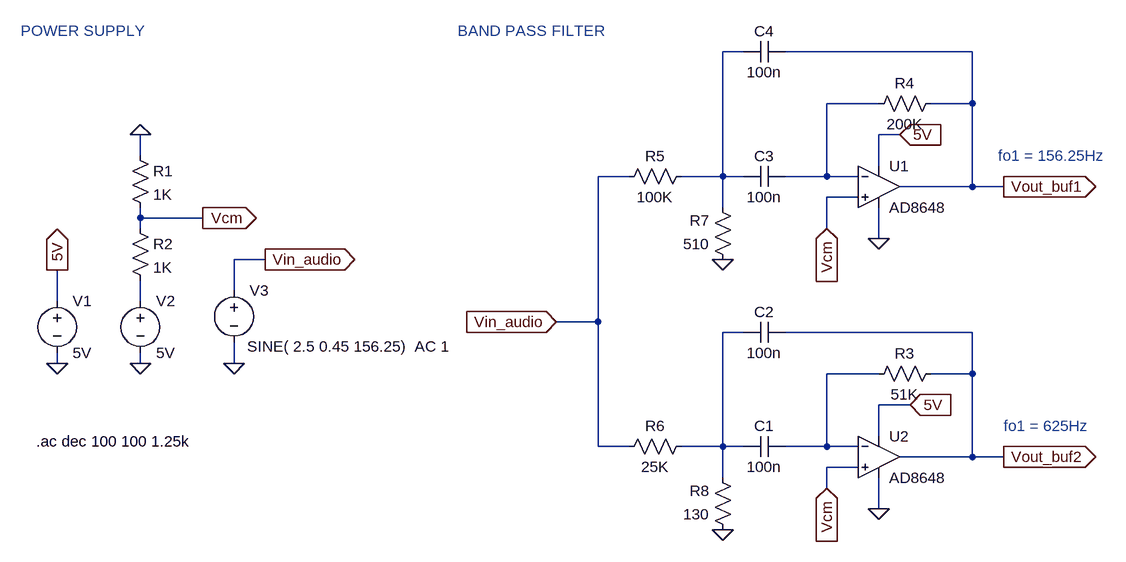
[diagram p0: schematic 04_Bandpass_Filter.asc.asc]
04_Bandpass_Filter.asc.asc, the LTspice schematic file:
Version 4.1
SHEET 1 1412 680
WIRE 656 -240 624 -240
WIRE 1008 -240 720 -240
WIRE 864 -160 784 -160
WIRE 1008 -160 1008 -240
WIRE 1008 -160 944 -160
WIRE 896 -112 864 -112
WIRE -272 -80 -272 -112
WIRE 864 -64 864 -112
WIRE 480 -48 432 -48
WIRE 624 -48 624 -240
WIRE 624 -48 560 -48
WIRE 656 -48 624 -48
WIRE 784 -48 784 -160
WIRE 784 -48 720 -48
WIRE 832 -48 784 -48
WIRE 1008 -32 1008 -160
WIRE 1008 -32 896 -32
WIRE 1056 -32 1008 -32
WIRE 832 -16 784 -16
WIRE 624 0 624 -48
WIRE -272 16 -272 0
WIRE -176 16 -272 16
WIRE -272 32 -272 16
WIRE 784 32 784 -16
WIRE 864 48 864 0
WIRE -80 80 -128 80
WIRE -128 128 -128 80
WIRE -400 144 -400 96
WIRE -272 144 -272 112
WIRE 432 176 432 -48
WIRE 432 176 368 176
WIRE 656 192 624 192
WIRE 1008 192 720 192
WIRE -400 240 -400 224
WIRE -272 240 -272 224
WIRE -128 240 -128 208
WIRE 864 256 784 256
WIRE 1008 256 1008 192
WIRE 1008 256 944 256
WIRE 912 304 864 304
WIRE 864 352 864 304
WIRE 432 368 432 176
WIRE 480 368 432 368
WIRE 624 368 624 192
WIRE 624 368 560 368
WIRE 656 368 624 368
WIRE 784 368 784 256
WIRE 784 368 720 368
WIRE 832 368 784 368
WIRE 1008 384 1008 256
WIRE 1008 384 896 384
WIRE 1056 384 1008 384
WIRE 832 400 784 400
WIRE 624 416 624 368
WIRE 784 432 784 400
WIRE 864 464 864 416
FLAG -400 240 0
FLAG -400 96 5V
IOPIN -400 96 Out
FLAG -272 240 0
FLAG -272 -112 0
FLAG -176 16 Vcm
IOPIN -176 16 Out
FLAG -128 240 0
FLAG -80 80 Vin_audio
IOPIN -80 80 Out
FLAG 864 48 0
FLAG 864 464 0
FLAG 784 32 Vcm
IOPIN 784 32 In
FLAG 784 432 Vcm
IOPIN 784 432 In
FLAG 896 -112 5V
IOPIN 896 -112 In
FLAG 912 304 5V
IOPIN 912 304 In
FLAG 624 80 0
FLAG 624 496 0
FLAG 368 176 Vin_audio
IOPIN 368 176 In
FLAG 1056 -32 Vout_buf1
IOPIN 1056 -32 Out
FLAG 1056 384 Vout_buf2
IOPIN 1056 384 Out
SYMBOL voltage -400 128 R0
WINDOW 123 0 0 Left 0
WINDOW 39 0 0 Left 0
SYMATTR InstName V1
SYMATTR Value 5V
SYMBOL voltage -272 128 R0
WINDOW 123 0 0 Left 0
WINDOW 39 0 0 Left 0
SYMATTR InstName V2
SYMATTR Value 5V
SYMBOL res -288 16 R0
SYMATTR InstName R2
SYMATTR Value 1K
SYMBOL res -288 -96 R0
SYMATTR InstName R1
SYMATTR Value 1K
SYMBOL voltage -128 112 R0
WINDOW 3 20 102 Left 2
WINDOW 123 0 0 Left 0
WINDOW 39 0 0 Left 0
SYMATTR Value SINE( 2.5 0.45 156.25)  AC 1
SYMATTR InstName V3
SYMBOL OpAmps\\AD8648 864 -96 R0
SYMATTR InstName U1
SYMBOL OpAmps\\AD8648 864 320 R0
SYMATTR InstName U2
SYMBOL res 960 240 R90
WINDOW 0 0 56 VBottom 2
WINDOW 3 32 56 VTop 2
SYMATTR InstName R3
SYMATTR Value 51K
SYMBOL res 960 -176 R90
WINDOW 0 0 56 VBottom 2
WINDOW 3 32 56 VTop 2
SYMATTR InstName R4
SYMATTR Value 200K
SYMBOL cap 720 352 R90
WINDOW 0 0 32 VBottom 2
WINDOW 3 32 32 VTop 2
SYMATTR InstName C1
SYMATTR Value 100n
SYMBOL res 576 -64 R90
WINDOW 0 0 56 VBottom 2
WINDOW 3 32 56 VTop 2
SYMATTR InstName R5
SYMATTR Value 100K
SYMBOL res 576 352 R90
WINDOW 0 0 56 VBottom 2
WINDOW 3 32 56 VTop 2
SYMATTR InstName R6
SYMATTR Value 25K
SYMBOL res 640 96 R180
WINDOW 0 36 76 Left 2
WINDOW 3 36 40 Left 2
SYMATTR InstName R7
SYMATTR Value 510
SYMBOL res 640 512 R180
WINDOW 0 36 76 Left 2
WINDOW 3 36 40 Left 2
SYMATTR InstName R8
SYMATTR Value 130
SYMBOL cap 720 176 R90
WINDOW 0 0 32 VBottom 2
WINDOW 3 32 32 VTop 2
SYMATTR InstName C2
SYMATTR Value 100n
SYMBOL cap 720 -64 R90
WINDOW 0 0 32 VBottom 2
WINDOW 3 32 32 VTop 2
SYMATTR InstName C3
SYMATTR Value 100n
SYMBOL cap 720 -256 R90
WINDOW 0 0 32 VBottom 2
WINDOW 3 32 32 VTop 2
SYMATTR InstName C4
SYMATTR Value 100n
TEXT -456 -272 Left 2 ;POWER SUPPLY
TEXT 216 -272 Left 2 ;BAND PASS FILTER
TEXT 1048 -80 Left 2 ;fo1 = 156.25Hz
TEXT 1056 336 Left 2 ;fo1 = 625Hz
TEXT -432 360 Left 2 !.ac dec 100 100 1.25k

The netlist it stands for:
* 04_Bandpass_Filter.asc.asc
V1 5V 0 5V
V2 N003 0 5V
R2 Vcm N003 1K
R1 0 Vcm 1K
V3 Vin_audio 0 SINE( 2.5 0.45 156.25)  AC 1
X§U1 Vcm N002 5V 0 Vout_buf1 AD8648  ; pins In+ In- V+ V- OUT
X§U2 Vcm N005 5V 0 Vout_buf2 AD8648  ; pins In+ In- V+ V- OUT
R3 Vout_buf2 N005 51K
R4 Vout_buf1 N002 200K
C1 N005 N004 100n
R5 N001 Vin_audio 100K
R6 N004 Vin_audio 25K
R7 0 N001 510
R8 0 N004 130
C2 Vout_buf2 N004 100n
C3 N002 N001 100n
C4 Vout_buf1 N001 100n
* POWER SUPPLY
* BAND PASS FILTER
* fo1 = 156.25Hz
* fo1 = 625Hz
.ac dec 100 100 1.25k
.lib ADI.lib
.backanno
.end